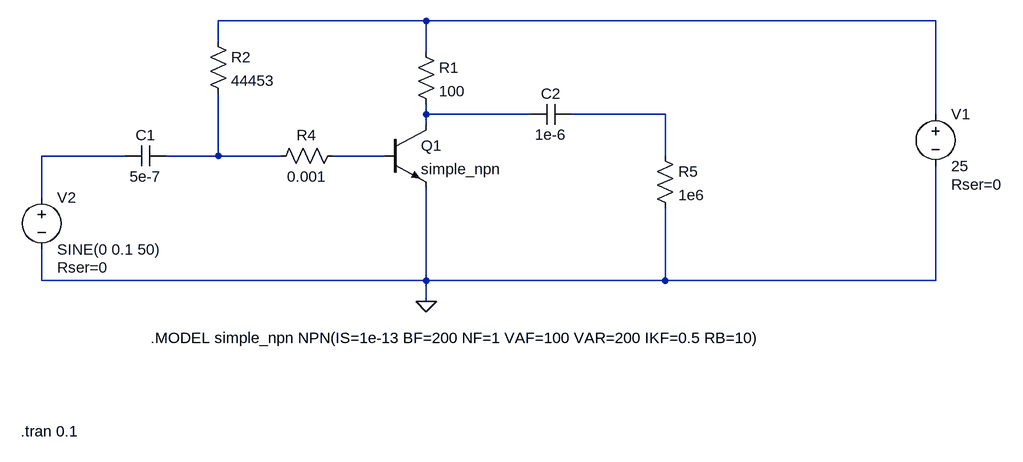
[diagram p0: schematic Eigen_RW_1f.asc]
Eigen_RW_1f.asc, the LTspice schematic file:
Version 4
SHEET 1 4936 824
WIRE 240 -32 -80 -32
WIRE 1024 -32 240 -32
WIRE -80 0 -80 -32
WIRE 240 16 240 -32
WIRE 240 112 240 96
WIRE 400 112 240 112
WIRE 608 112 464 112
WIRE 1024 112 1024 -32
WIRE 240 128 240 112
WIRE -224 176 -352 176
WIRE -80 176 -80 80
WIRE -80 176 -160 176
WIRE 16 176 -80 176
WIRE 176 176 96 176
WIRE 608 176 608 112
WIRE -352 240 -352 176
WIRE -352 368 -352 320
WIRE 240 368 240 224
WIRE 240 368 -352 368
WIRE 608 368 608 256
WIRE 608 368 240 368
WIRE 1024 368 1024 192
WIRE 1024 368 608 368
WIRE 240 400 240 368
FLAG 240 400 0
SYMBOL res 224 0 R0
SYMATTR InstName R1
SYMATTR Value 100
SYMBOL voltage 1024 96 R0
WINDOW 123 0 0 Left 0
WINDOW 39 24 124 Left 2
SYMATTR SpiceLine Rser=0
SYMATTR InstName V1
SYMATTR Value 25
SYMBOL res -96 -16 R0
SYMATTR InstName R2
SYMATTR Value 44453
SYMBOL res 112 160 R90
WINDOW 0 0 56 VBottom 2
WINDOW 3 32 56 VTop 2
SYMATTR InstName R4
SYMATTR Value 0.001
SYMBOL cap -160 160 R90
WINDOW 0 0 32 VBottom 2
WINDOW 3 32 32 VTop 2
SYMATTR InstName C1
SYMATTR Value 5e-7
SYMBOL cap 464 96 R90
WINDOW 0 0 32 VBottom 2
WINDOW 3 32 32 VTop 2
SYMATTR InstName C2
SYMATTR Value 1e-6
SYMBOL res 592 160 R0
SYMATTR InstName R5
SYMATTR Value 1e6
SYMBOL voltage -352 224 R0
WINDOW 123 0 0 Left 0
WINDOW 39 24 124 Left 2
SYMATTR SpiceLine Rser=0
SYMATTR InstName V2
SYMATTR Value SINE(0 0.1 50)
SYMBOL npn 176 128 R0
SYMATTR InstName Q1
SYMATTR Value simple_npn
TEXT -384 600 Left 2 !.tran 0.1
TEXT -184 456 Left 2 !.MODEL simple_npn NPN(IS=1e-13 BF=200 NF=1 VAF=100 VAR=200 IKF=0.5 RB=10)

The netlist it stands for:
* Eigen_RW_1f.asc
R1 N001 N002 100
V1 N001 0 25 Rser=0
R2 N001 N005 44453
R4 N006 N005 0.001
C1 N005 N004 5e-7
C2 N003 N002 1e-6
R5 N003 0 1e6
V2 N004 0 SINE(0 0.1 50) Rser=0
Q1 N002 N006 0 0 simple_npn
.model NPN NPN
.model PNP PNP
.lib standard.bjt
.tran 0.1
.MODEL simple_npn NPN(IS=1e-13 BF=200 NF=1 VAF=100 VAR=200 IKF=0.5 RB=10)
.backanno
.end